# EAGLE schematic 000018 PGKB Rev 1.00 (EAGLE 9.3.0)
DATE: 11.02.2019; OWNER: Kallio Designs; PRODUCT_NUMBER: 000017; REVISION: 1.00; TITLE: PGKB
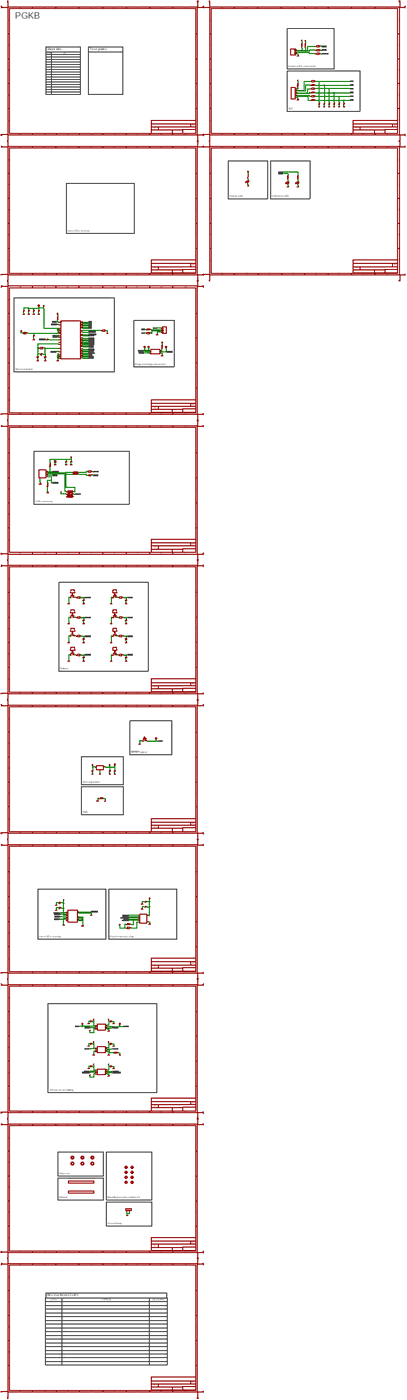
[diagram p0: schematic, sheet 1, overview]
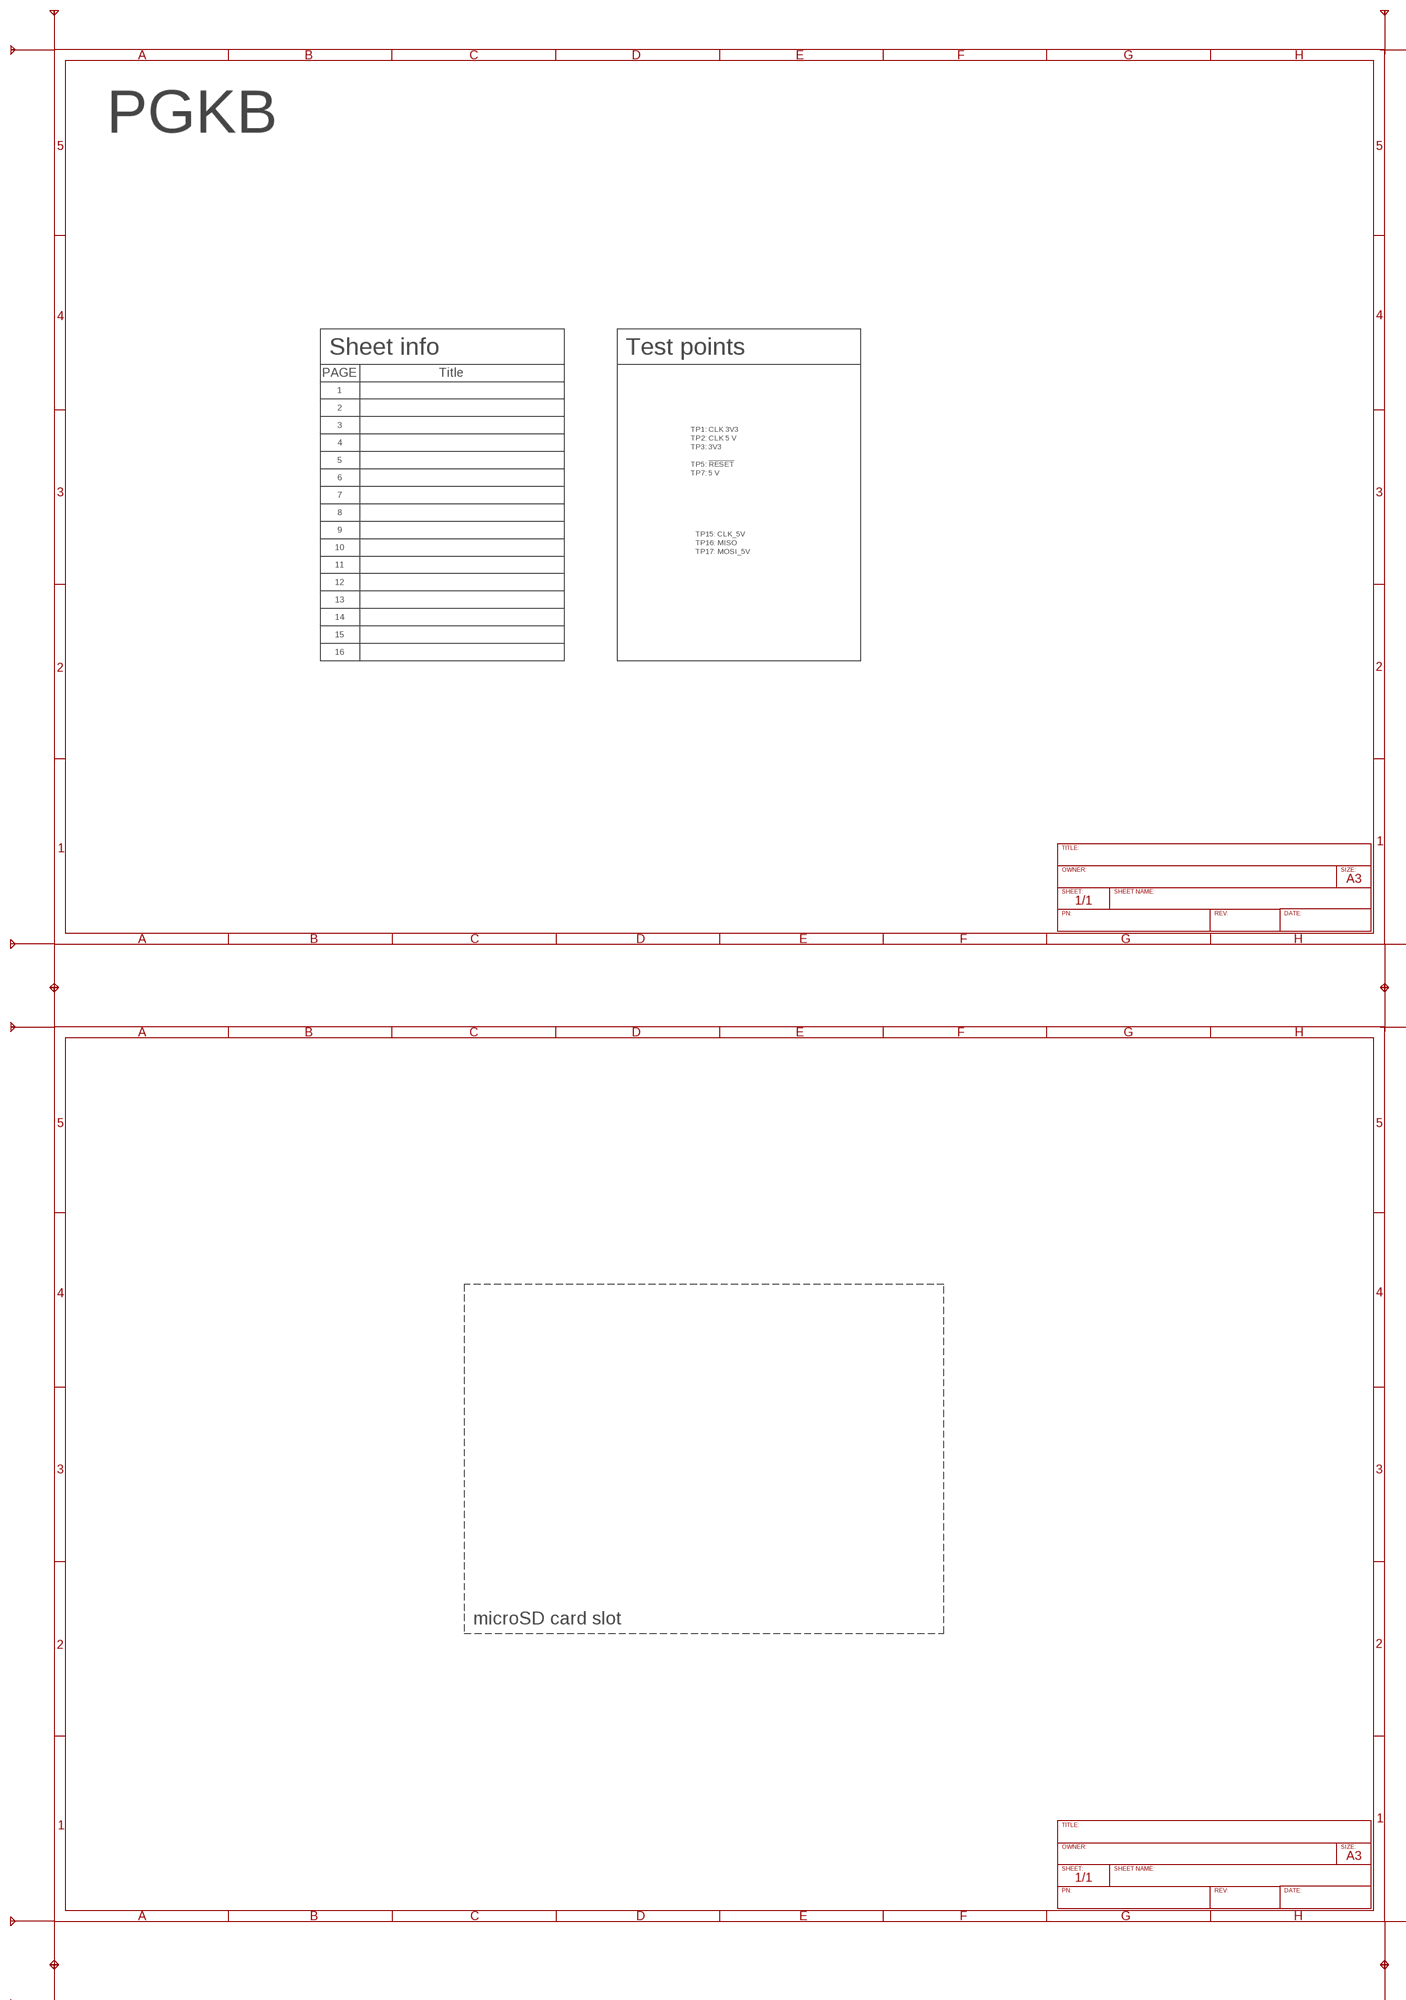
[diagram p1: schematic, sheet 1, part 1 of 7]
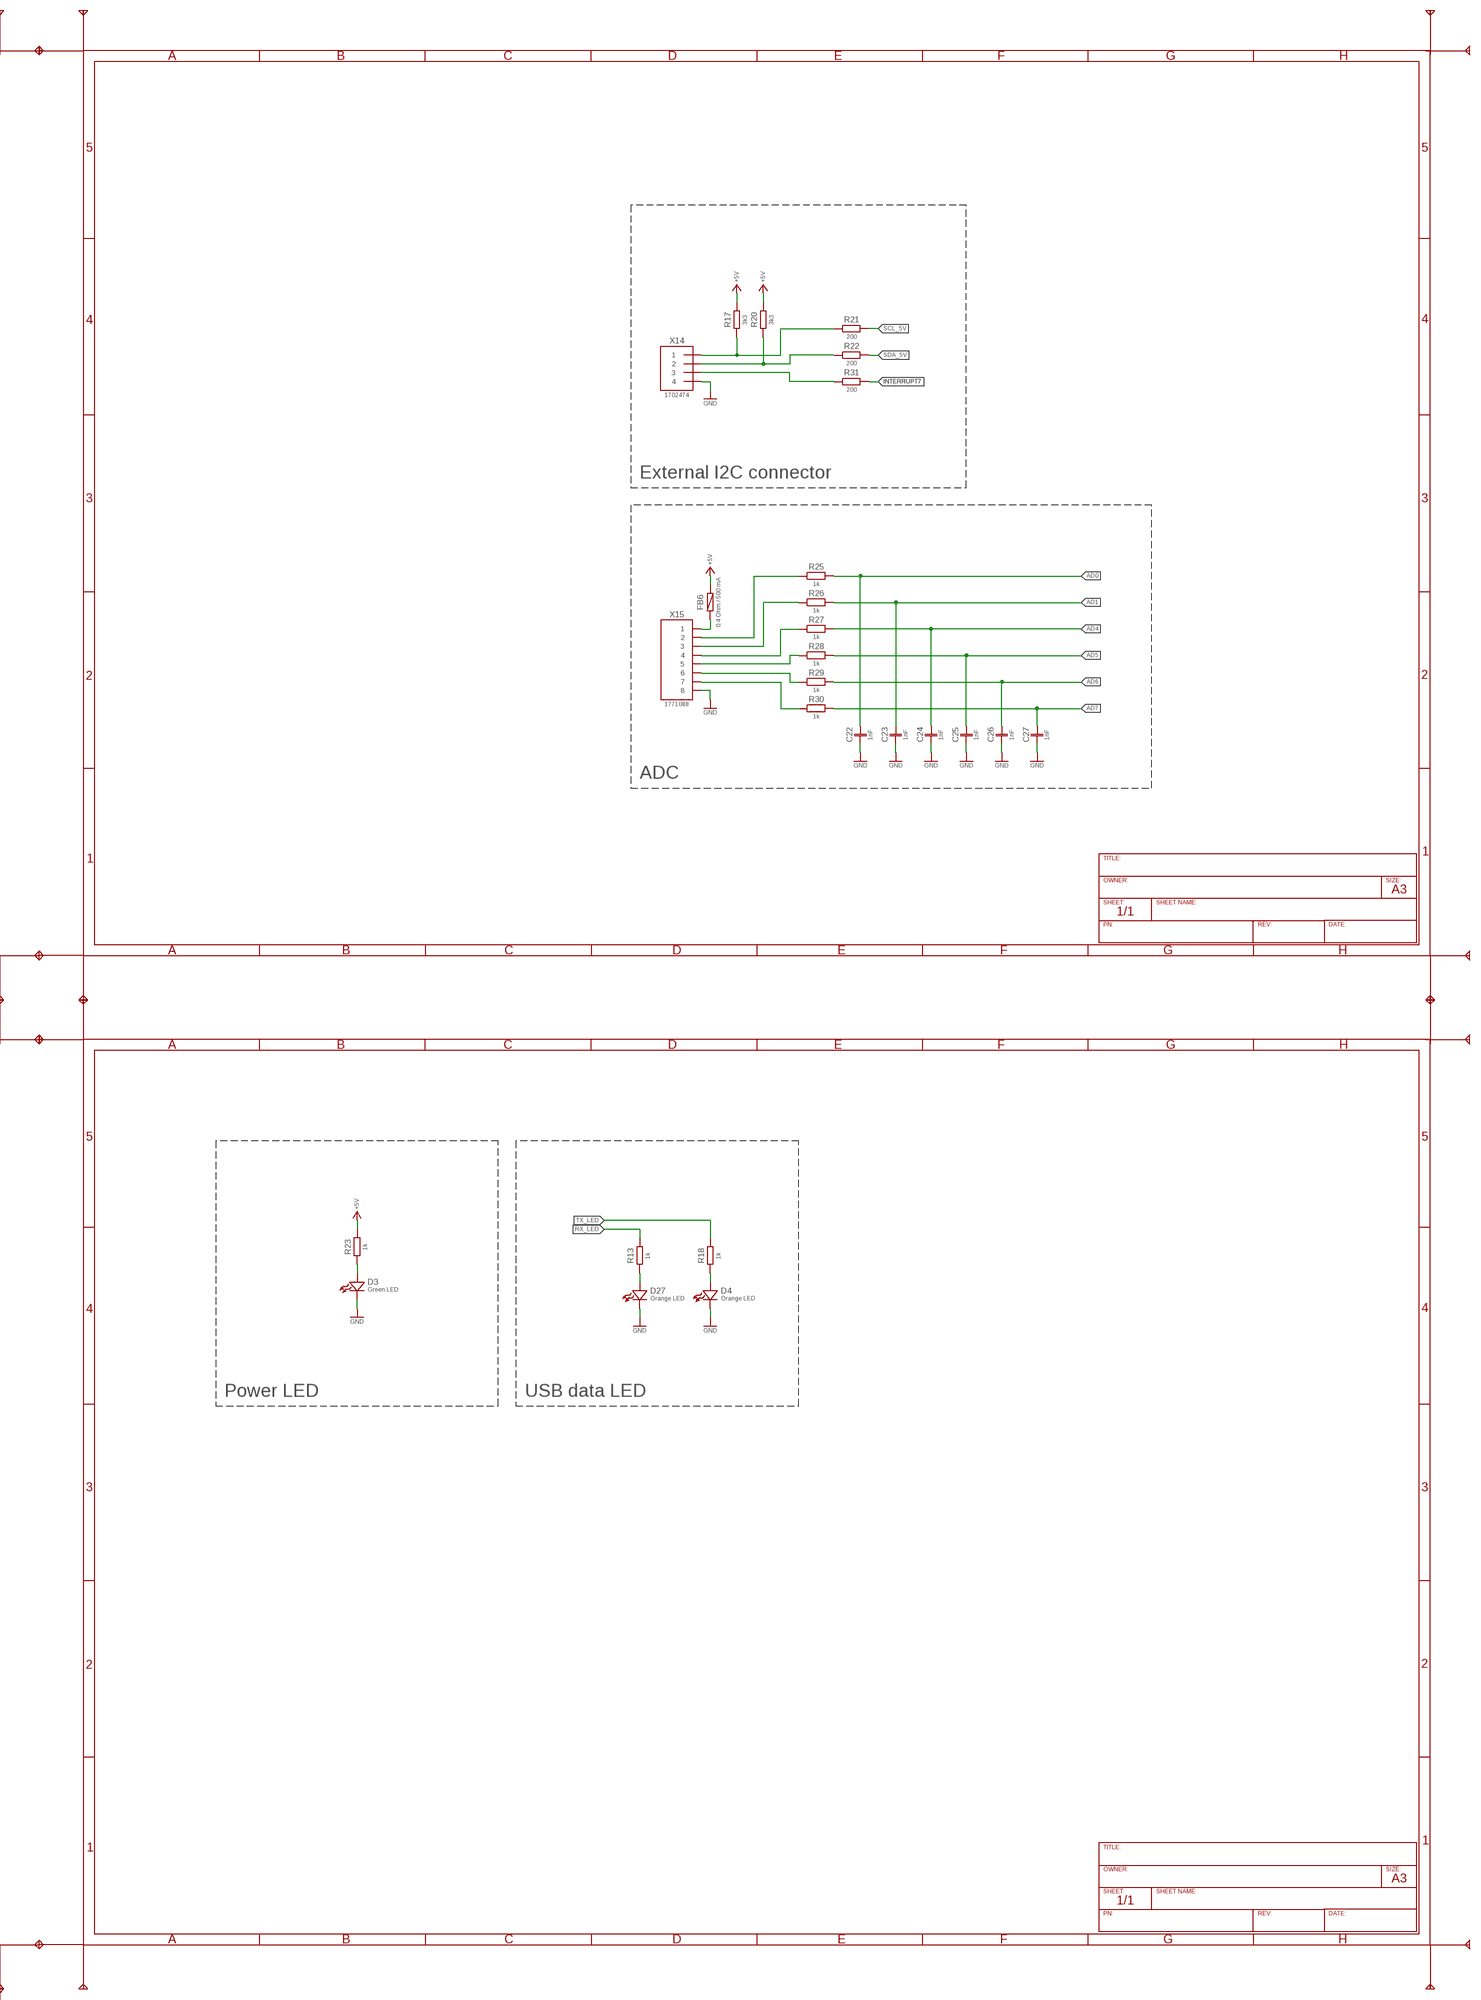
[diagram p2: schematic, sheet 1, part 2 of 7]
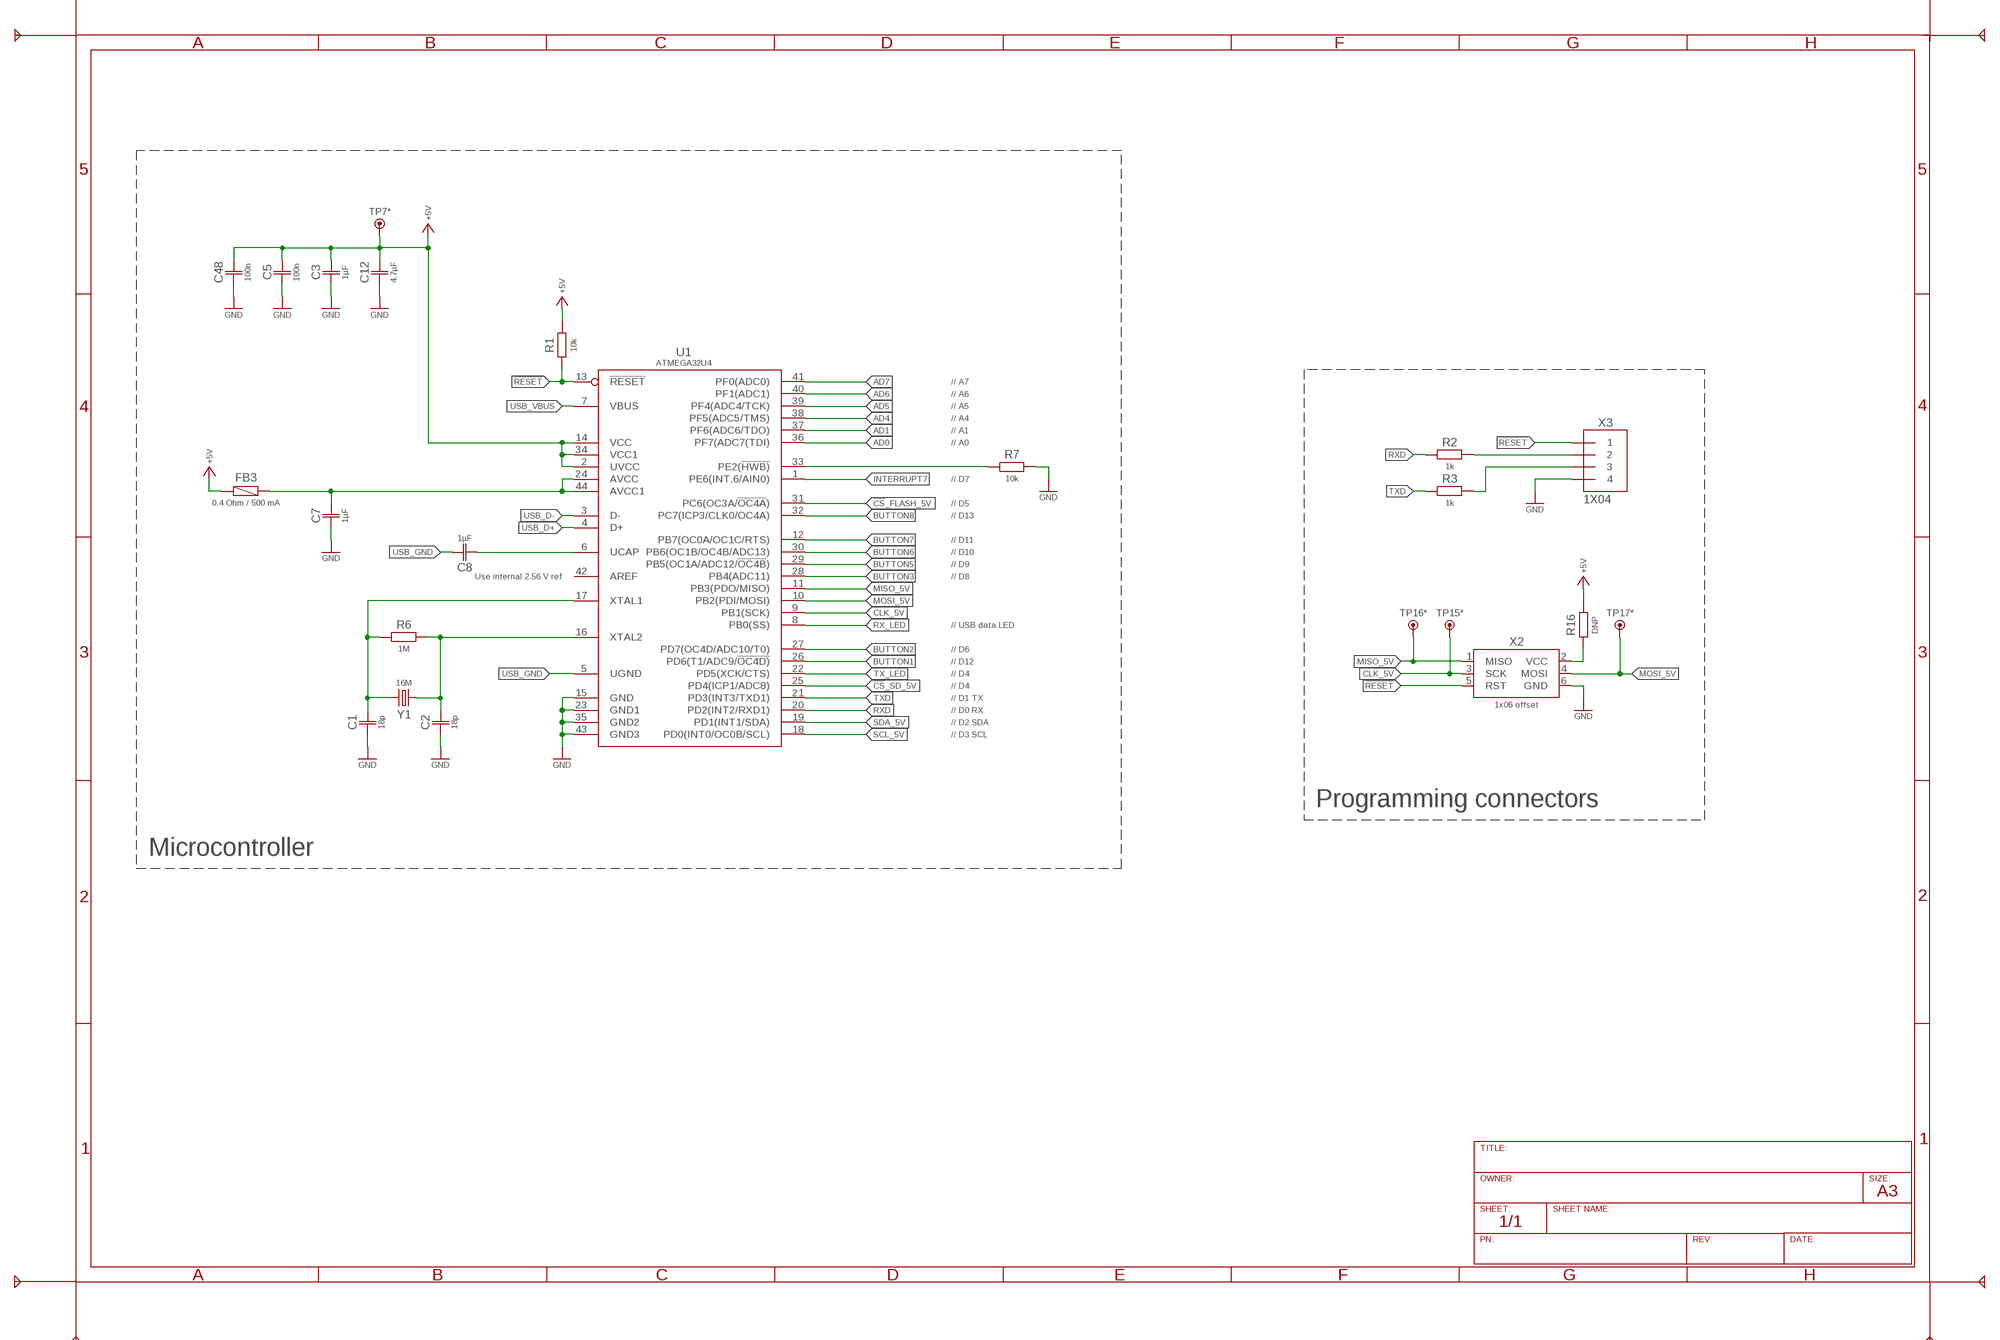
[diagram p3: schematic, sheet 1, part 3 of 7]
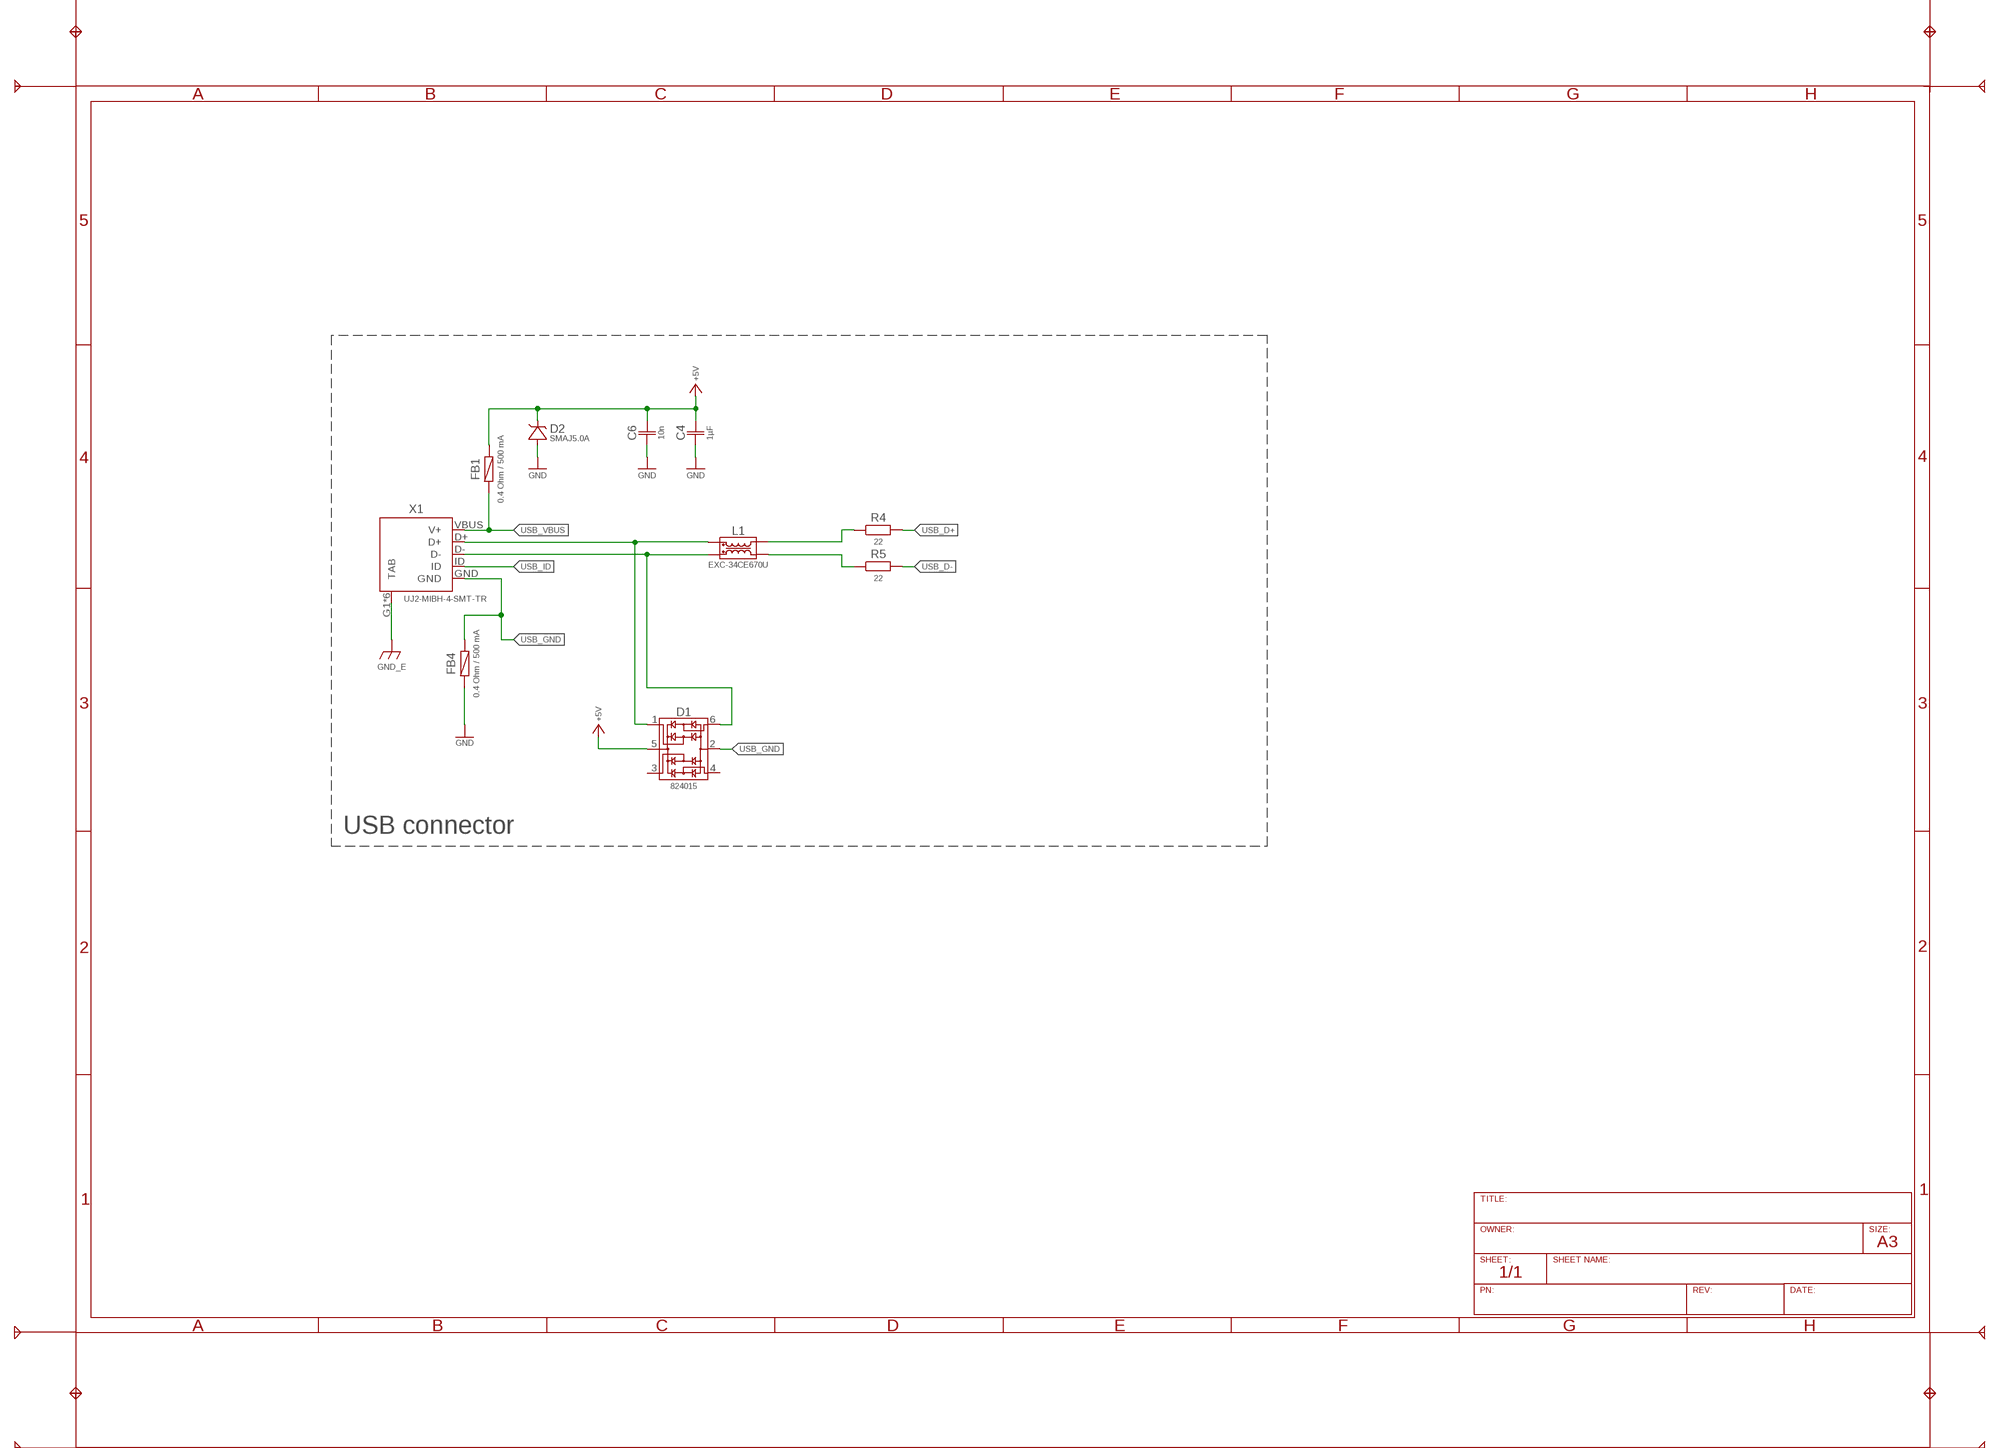
[diagram p4: schematic, sheet 1, part 4 of 7]
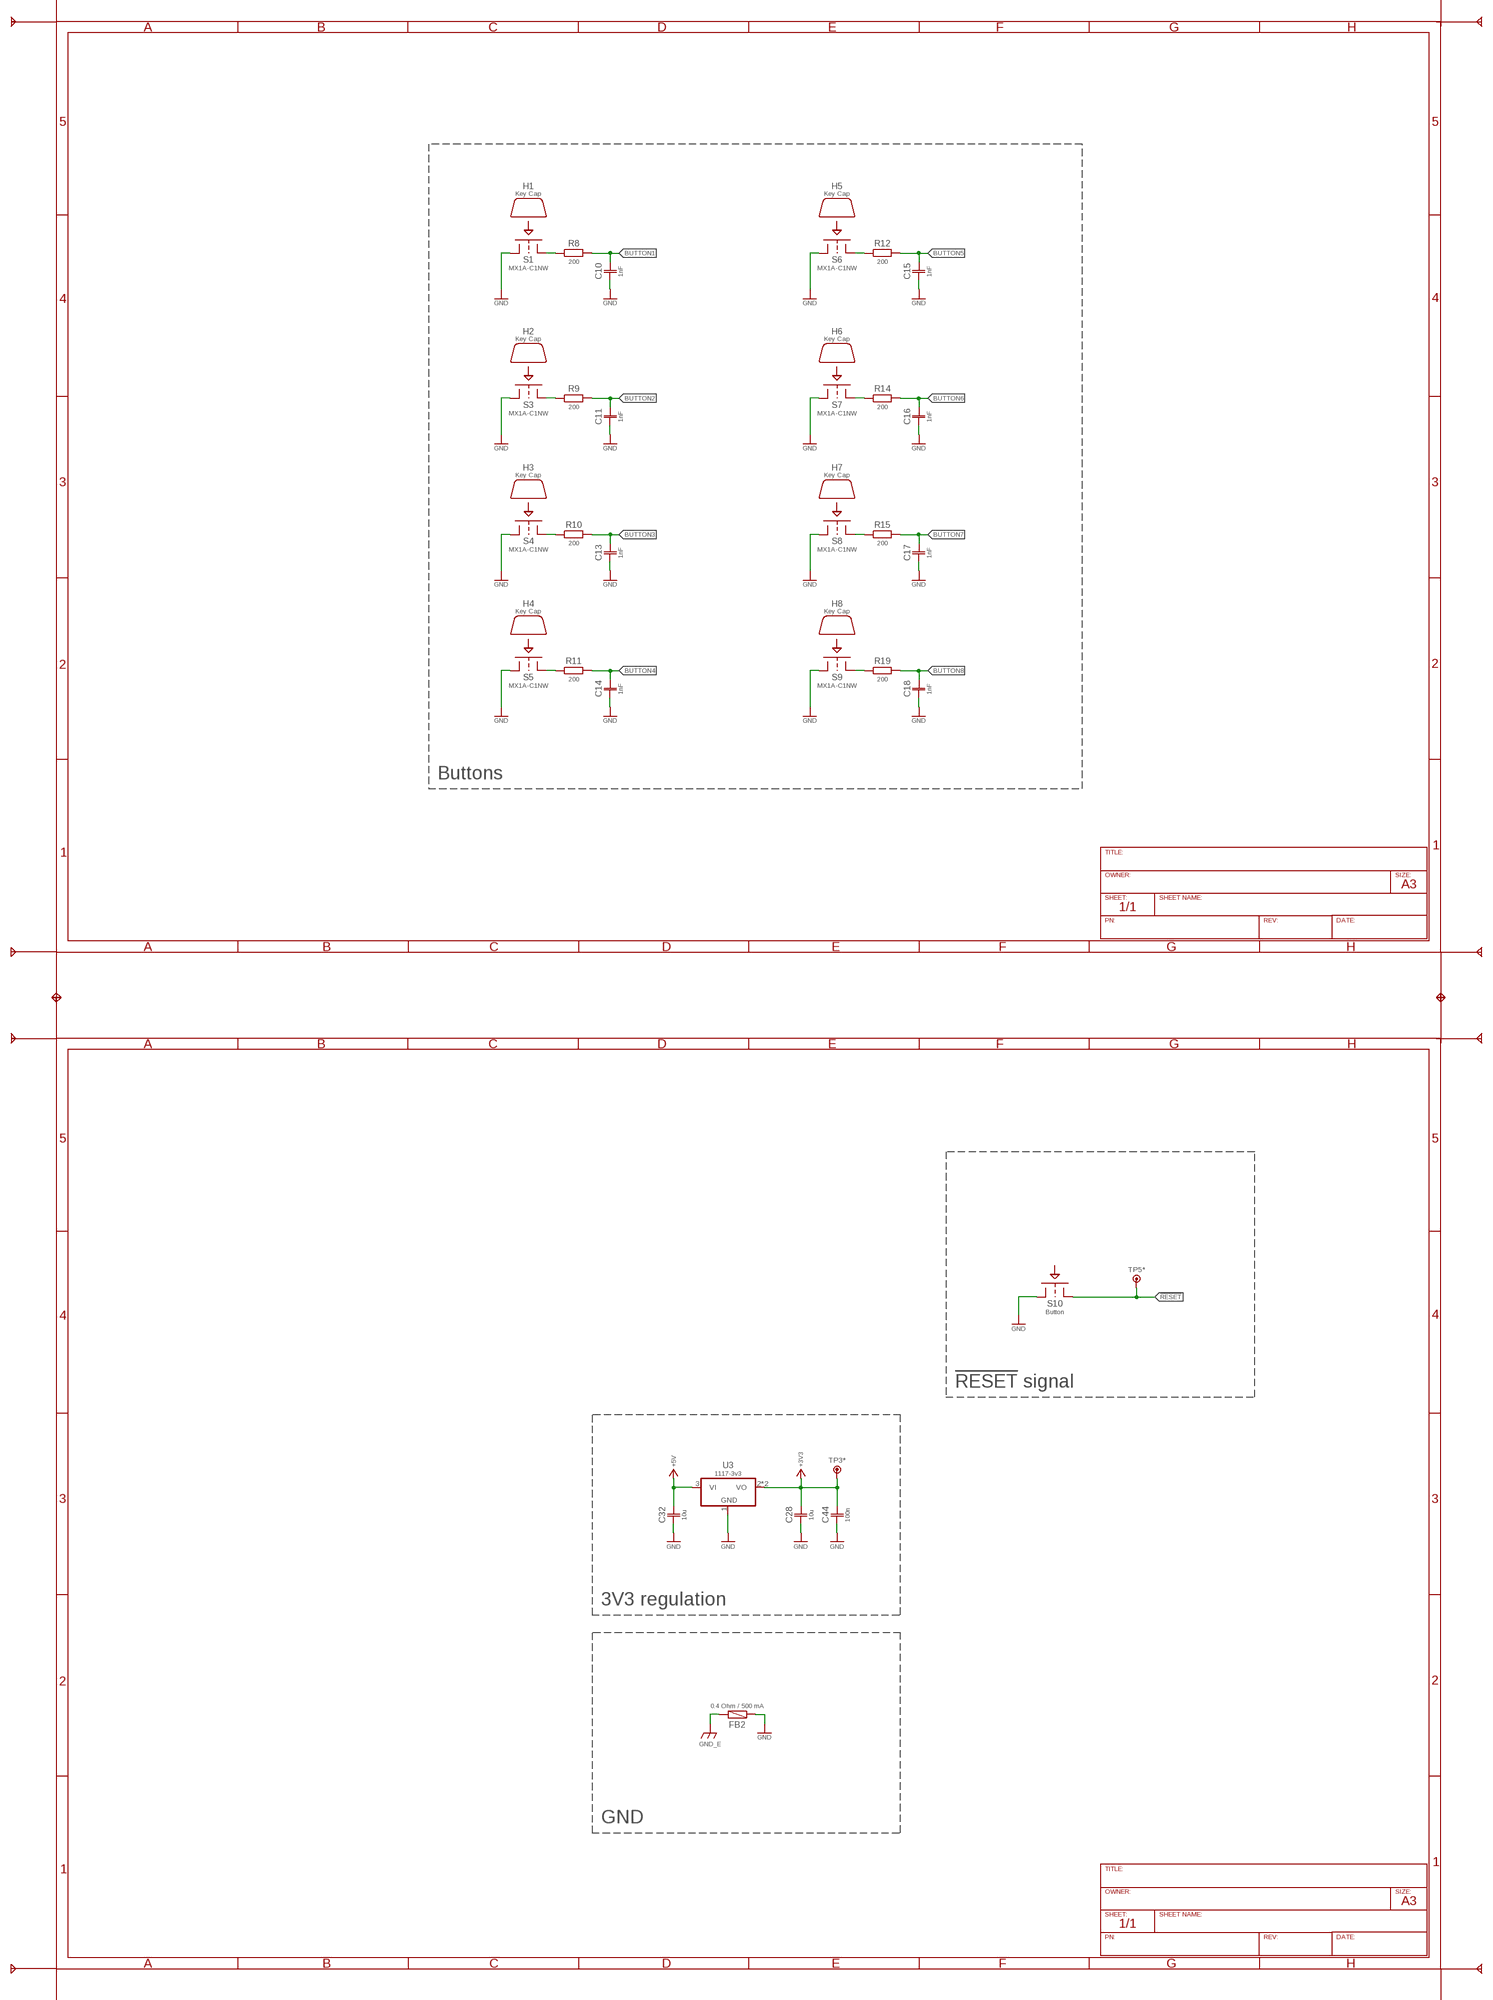
[diagram p5: schematic, sheet 1, part 5 of 7]
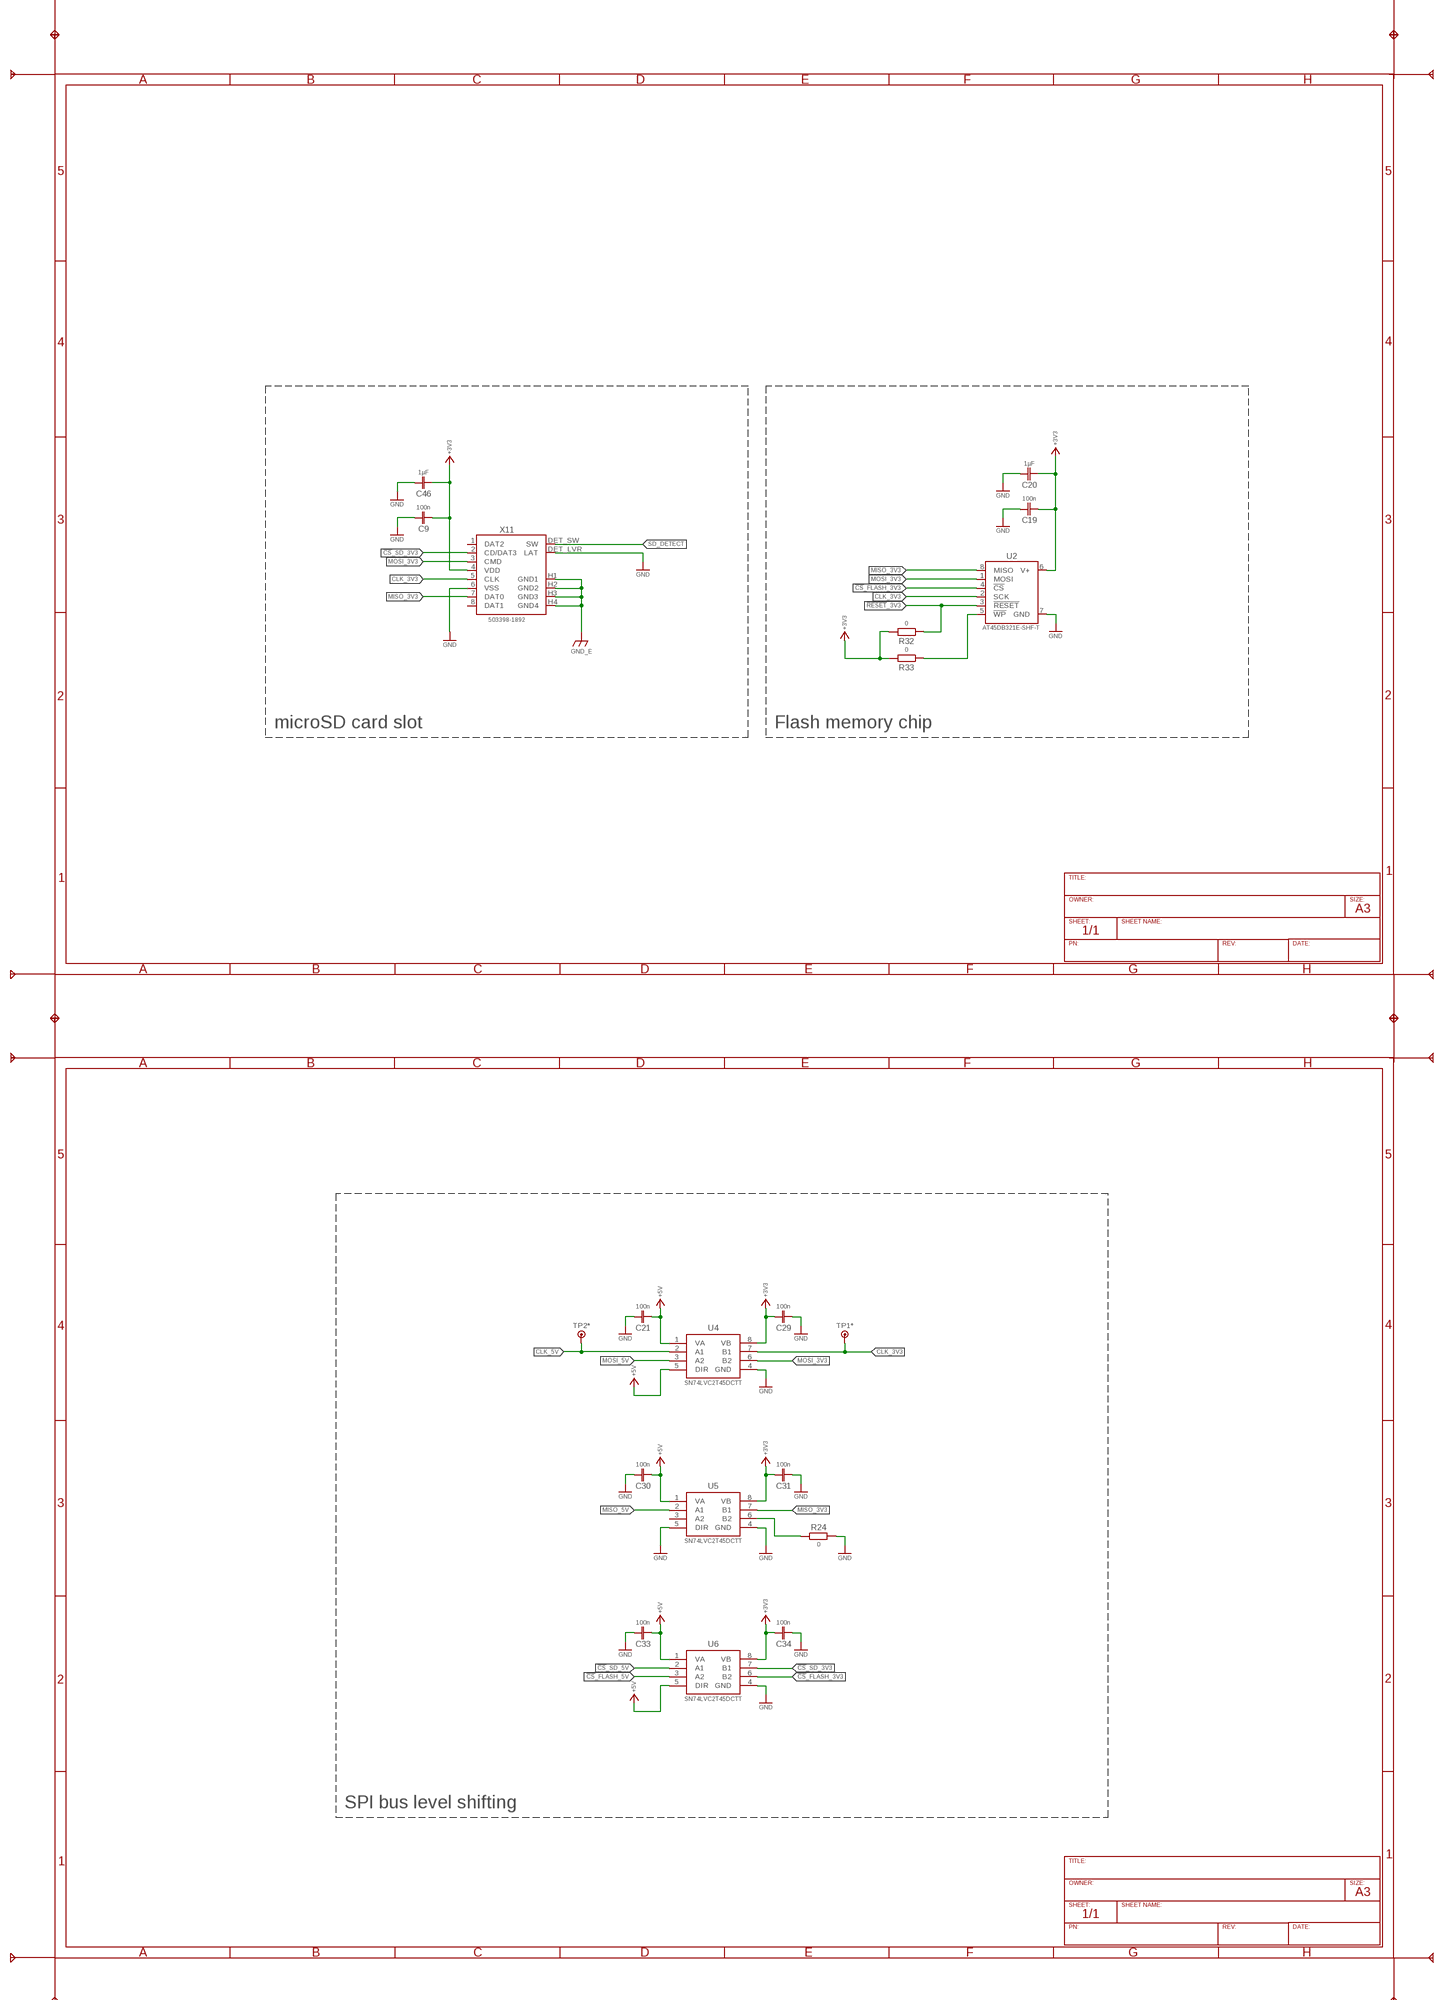
[diagram p6: schematic, sheet 1, part 6 of 7]
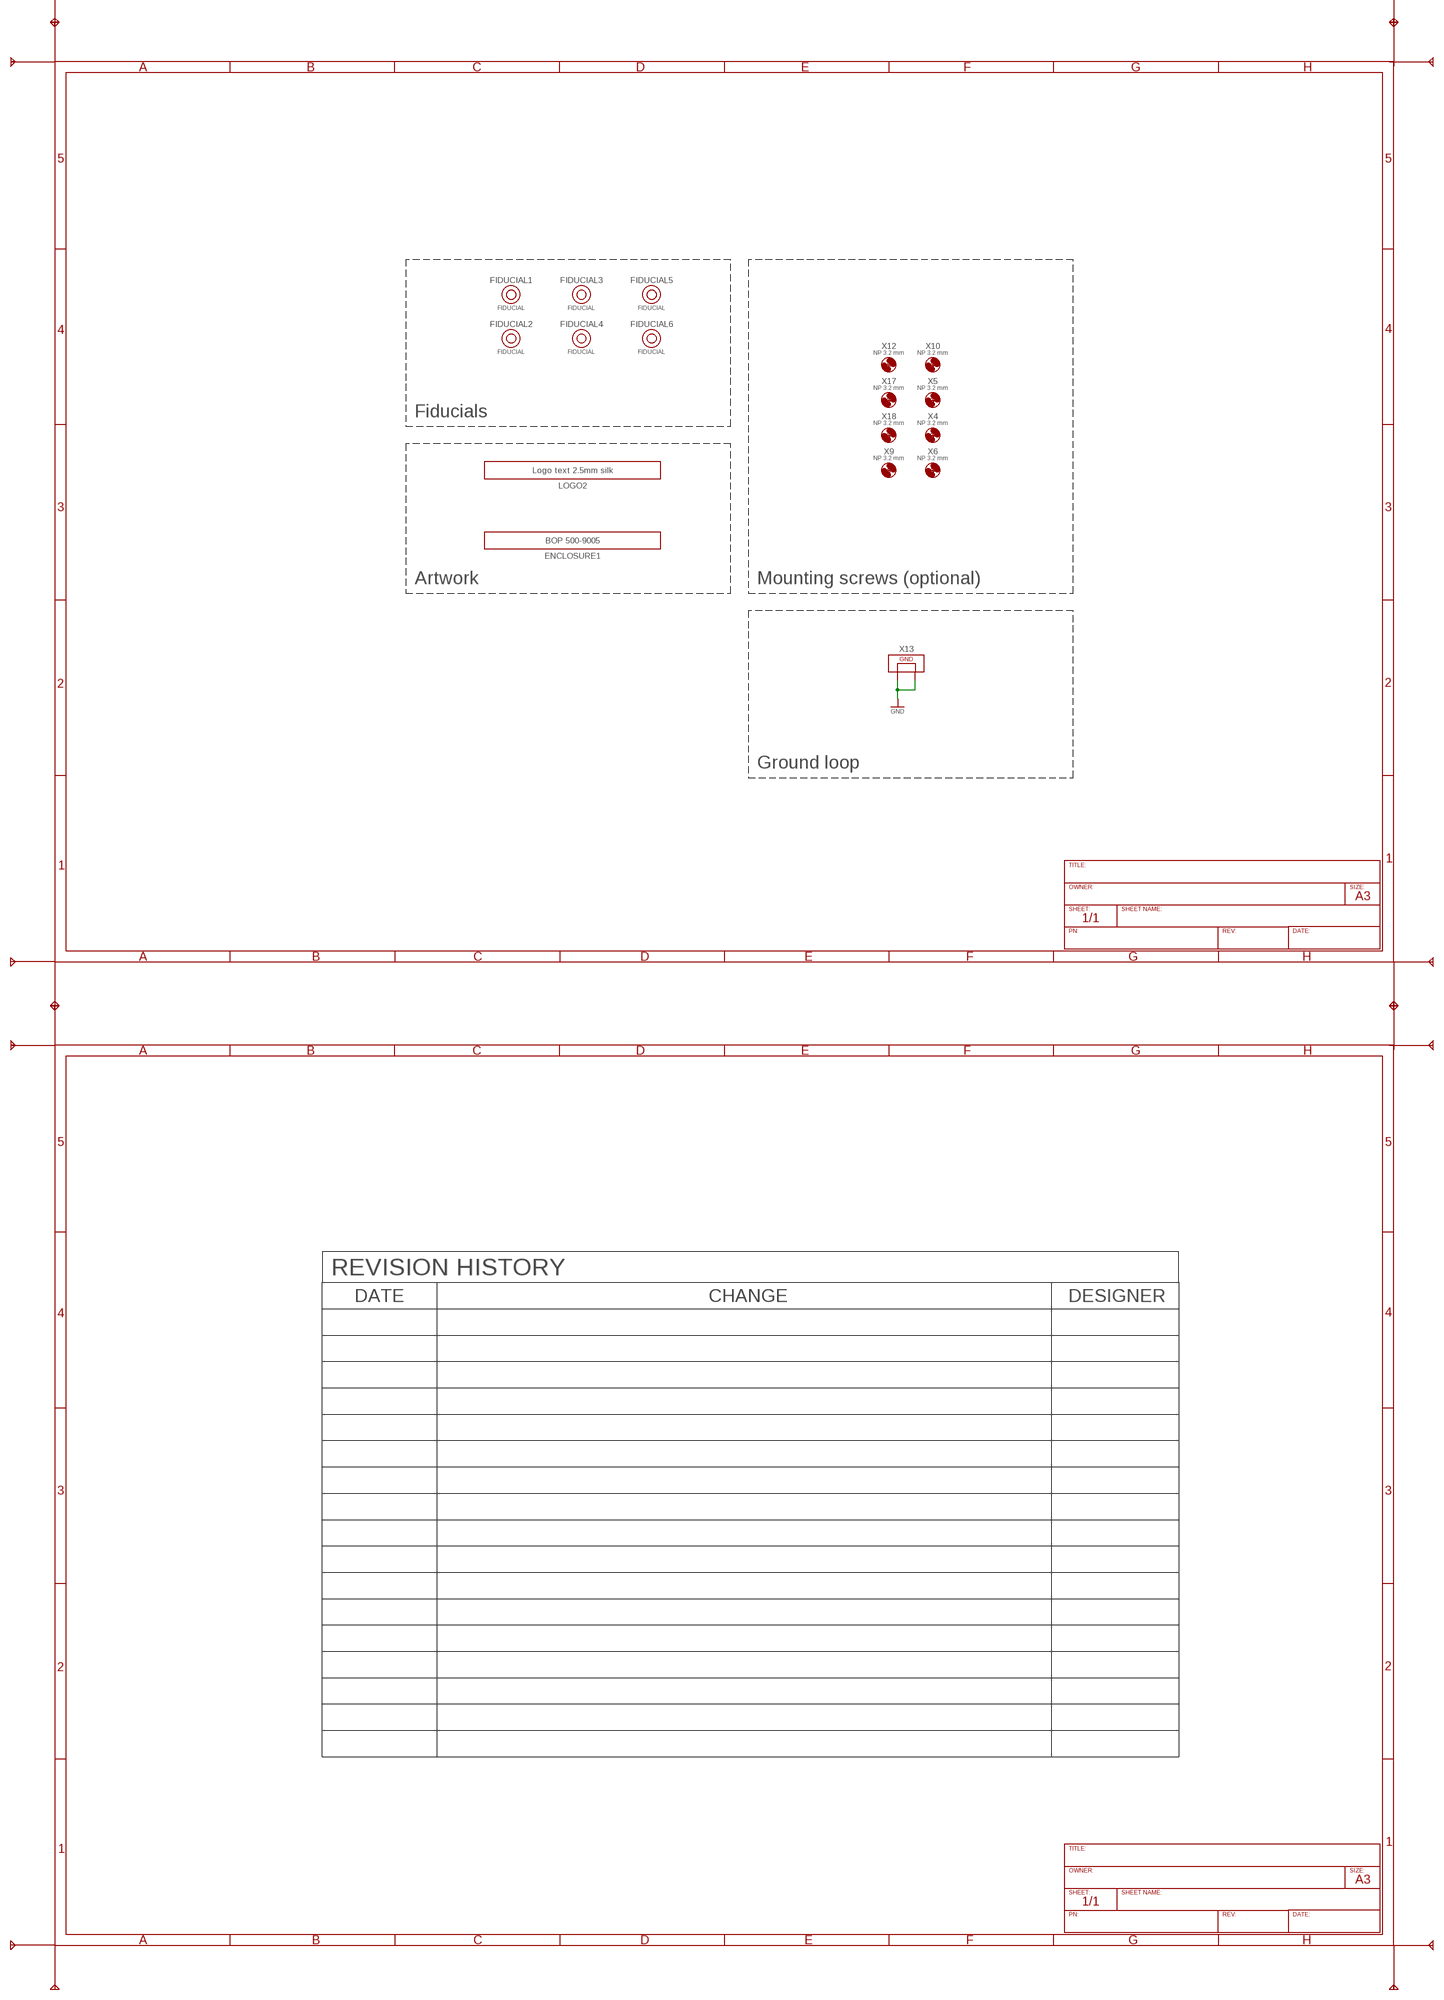
[diagram p7: schematic, sheet 1, part 7 of 7]
REVINFO1 (ART_REVISION_HISTORY): CODE: DNP; DNP: T; MANUFACTURER: DNP; MFG_PARTNO: DNP; PRICE: 0; SUPPLIER: DNP; SUPPLIER_PARTNO: DNP
SHEETINFO1 (ART_SHEET_INFO_1-16): CODE: DNP; DNP: T; MANUFACTURER: DNP; MFG_PARTNO: DNP; PRICE: 0; SUPPLIER: DNP; SUPPLIER_PARTNO: DNP
TEST_POINTS1 (ART_TEST_POINTS): CODE: DNP; DNP: T; MANUFACTURER: DNP; MFG_PARTNO: DNP; PRICE: 0; SUPPLIER: DNP; SUPPLIER_PARTNO: DNP

## Parts
C1  C0805_18PF_50V_NP0  [CAPC2012X160]
C2  C0805_18PF_50V_NP0  [CAPC2012X160]
C3  C0805_1UF_50V_X5R  [CAPC2012X160]
C4  C0805_1UF_50V_X5R  [CAPC2012X160]
C5  C0603_100NF_50V_X7R  [CAPC1608X90]
C6  C0805_10NF_50V_X7R  [CAPC2012X160]
C7  C0805_1UF_50V_X5R  [CAPC2012X160]
C8  C0805_1UF_50V_X5R  [CAPC2012X160]
C9  C0603_100NF_50V_X7R  [CAPC1608X90]
C10  C0805_1NF_50V_X7R  [CAPC2012X160]
C11  C0805_1NF_50V_X7R  [CAPC2012X160]
C12  C0805_4.7UF_25V_X5R  [CAPC2012X160]
C13  C0805_1NF_50V_X7R  [CAPC2012X160]
C14  C0805_1NF_50V_X7R  [CAPC2012X160]
C15  C0805_1NF_50V_X7R  [CAPC2012X160]
C16  C0805_1NF_50V_X7R  [CAPC2012X160]
C17  C0805_1NF_50V_X7R  [CAPC2012X160]
C18  C0805_1NF_50V_X7R  [CAPC2012X160]
C19  C0603_100NF_50V_X7R  [CAPC1608X90]
C20  C0805_1UF_50V_X5R  [CAPC2012X160]
C21  C0603_100NF_50V_X7R  [CAPC1608X90]
C22  C0805_1NF_50V_X7R  [CAPC2012X160]
C23  C0805_1NF_50V_X7R  [CAPC2012X160]
C24  C0805_1NF_50V_X7R  [CAPC2012X160]
C25  C0805_1NF_50V_X7R  [CAPC2012X160]
C26  C0805_1NF_50V_X7R  [CAPC2012X160]
C27  C0805_1NF_50V_X7R  [CAPC2012X160]
C28  C1206_10UF_16V_Y5V  [CAPC3216X200]
C29  C0603_100NF_50V_X7R  [CAPC1608X90]
C30  C0603_100NF_50V_X7R  [CAPC1608X90]
C31  C0603_100NF_50V_X7R  [CAPC1608X90]
C32  C1206_10UF_16V_Y5V  [CAPC3216X200]
C33  C0603_100NF_50V_X7R  [CAPC1608X90]
C34  C0603_100NF_50V_X7R  [CAPC1608X90]
C44  C0603_100NF_50V_X7R  [CAPC1608X90]
C46  C0805_1UF_50V_X5R  [CAPC2012X160]
C48  C0603_100NF_50V_X7R  [CAPC1608X90]
D1  DIODE_TVS_5V_BI_824015  [SOP95P280X120-6N]
D2  DIODE_TVS_5V_SMAJ5.0A  [DIOC530X280X230_SMA_A]
D3  LED_0603_GREEN_CLEAR_APTD1608CGCK  [LEDM1608X80N_DOME]
D4  LED_0603_AMBER_DIFF_LOQ976-PS-25  [LEDM1608X80N]
D27  LED_0603_AMBER_DIFF_LOQ976-PS-25  [LEDM1608X80N]
ENCLOSURE1  ENCLOSURE_BOPLA_BOP-500-9005-TOP  [ENCLOSURE_BOPLA_BOP-500-9005]
FB1  FERRITE_0805_0A5  [RESC2012X50]
FB2  FERRITE_0805_0A5  [RESC2012X50]
FB3  FERRITE_0805_0A5  [RESC2012X50]
FB4  FERRITE_0805_0A5  [RESC2012X50]
FB6  FERRITE_0805_0A5  [RESC2012X50]
FIDUCIAL1  FIDUCIAL  [FIDUCIAL]
FIDUCIAL2  FIDUCIAL  [FIDUCIAL]
FIDUCIAL3  FIDUCIAL  [FIDUCIAL]
FIDUCIAL4  FIDUCIAL  [FIDUCIAL]
FIDUCIAL5  FIDUCIAL  [FIDUCIAL]
FIDUCIAL6  FIDUCIAL  [FIDUCIAL]
H1  SWITCH_CAP_DSA_RELEG  [SWITCH_CAP_DSA_RELEG]
H2  SWITCH_CAP_DSA_RELEG  [SWITCH_CAP_DSA_RELEG]
H3  SWITCH_CAP_DSA_RELEG  [SWITCH_CAP_DSA_RELEG]
H4  SWITCH_CAP_DSA_RELEG  [SWITCH_CAP_DSA_RELEG]
H5  SWITCH_CAP_DSA_RELEG  [SWITCH_CAP_DSA_RELEG]
H6  SWITCH_CAP_DSA_RELEG  [SWITCH_CAP_DSA_RELEG]
H7  SWITCH_CAP_DSA_RELEG  [SWITCH_CAP_DSA_RELEG]
H8  SWITCH_CAP_DSA_RELEG  [SWITCH_CAP_DSA_RELEG]
L1  L_CHOKE_EXC-34CE670U  [IND_CHOKE_EXC-34]
LOGO2  ART_LOGO_TEXT_2.5MM-SILK  [ART_LOGO_TEXT_2.5MM_SILK]
R1  R0805_10K_5%  [RESC2012X50]
R2  R0805_1K_1%  [RESC2012X50]
R3  R0805_1K_1%  [RESC2012X50]
R4  R0603_22  [RESC1608X45N]
R5  R0603_22  [RESC1608X45N]
R6  R0805_1M_5%  [RESC2012X50]
R7  R0805_10K_5%  [RESC2012X50]
R8  R0805_200_1%  [RESC2012X50]
R9  R0805_200_1%  [RESC2012X50]
R10  R0805_200_1%  [RESC2012X50]
R11  R0805_200_1%  [RESC2012X50]
R12  R0805_200_1%  [RESC2012X50]
R13  R0805_1K_1%  [RESC2012X50]
R14  R0805_200_1%  [RESC2012X50]
R15  R0805_200_1%  [RESC2012X50]
R16  R0402_DNP  [RESC1005X35N]
R17  R0805_3K3_1%  [RESC2012X50]
R18  R0805_1K_1%  [RESC2012X50]
R19  R0805_200_1%  [RESC2012X50]
R20  R0805_3K3_1%  [RESC2012X50]
R21  R0805_200_1%  [RESC2012X50]
R22  R0805_200_1%  [RESC2012X50]
R23  R0805_1K_1%  [RESC2012X50]
R24  R0603_0  [RESC1608X45N]
R25  R0805_1K_1%  [RESC2012X50]
R26  R0805_1K_1%  [RESC2012X50]
R27  R0805_1K_1%  [RESC2012X50]
R28  R0805_1K_1%  [RESC2012X50]
R29  R0805_1K_1%  [RESC2012X50]
R30  R0805_1K_1%  [RESC2012X50]
R31  R0805_200_1%  [RESC2012X50]
R32  R0603_0  [RESC1608X45N]
R33  R0603_0  [RESC1608X45N]
S1  SWITCH_BUTTON_MX1A-C1NW  [SWITCH_BUTTON_CHERRY_MX]
S3  SWITCH_BUTTON_MX1A-C1NW  [SWITCH_BUTTON_CHERRY_MX]
S4  SWITCH_BUTTON_MX1A-C1NW  [SWITCH_BUTTON_CHERRY_MX]
S5  SWITCH_BUTTON_MX1A-C1NW  [SWITCH_BUTTON_CHERRY_MX]
S6  SWITCH_BUTTON_MX1A-C1NW  [SWITCH_BUTTON_CHERRY_MX]
S7  SWITCH_BUTTON_MX1A-C1NW  [SWITCH_BUTTON_CHERRY_MX]
S8  SWITCH_BUTTON_MX1A-C1NW  [SWITCH_BUTTON_CHERRY_MX]
S9  SWITCH_BUTTON_MX1A-C1NW  [SWITCH_BUTTON_CHERRY_MX]
S10  SWITCH_MOM_SPST_FSM4JSMA  [SWITCH_BUTTON_TE_FSM4JSMA]
TP1  PAD_TEST_POINT-2.5/0.7_A  [TEST_POINT_2.5MM_0.7HOLE_1SIDE]
TP2  PAD_TEST_POINT-2.5/0.7_A  [TEST_POINT_2.5MM_0.7HOLE_1SIDE]
TP3  PAD_TEST_POINT-2.5/0.7_A  [TEST_POINT_2.5MM_0.7HOLE_1SIDE]
TP5  PAD_TEST_POINT-2.5/0.7_A  [TEST_POINT_2.5MM_0.7HOLE_1SIDE]
TP7  PAD_TEST_POINT-2.5/0.7_A  [TEST_POINT_2.5MM_0.7HOLE_1SIDE]
TP15  PAD_TEST_POINT-2.5/0.7_A  [TEST_POINT_2.5MM_0.7HOLE_1SIDE]
TP16  PAD_TEST_POINT-2.5/0.7_A  [TEST_POINT_2.5MM_0.7HOLE_1SIDE]
TP17  PAD_TEST_POINT-2.5/0.7_A  [TEST_POINT_2.5MM_0.7HOLE_1SIDE]
U1  IC_MCU_ATMEGA32U4-AU  [QFP80P1000X1000X120-44R_N]
U2  IC_MEM_FLASH_AT45DB321E  [SOP127P800X175-8]
U3  IC_REG_3V3_1A_NCP1117LPST33T3G  [SOT223]
U4  IC_LEVEL_SHIFTER_SN74LVC2T45  [SOP65P400X130-8]
U5  IC_LEVEL_SHIFTER_SN74LVC2T45  [SOP65P400X130-8]
U6  IC_LEVEL_SHIFTER_SN74LVC2T45  [SOP65P400X130-8]
X1  CON_USB_MICROB_UJ2-MIBH-4-SMT-TR-MAN  [CON_USB_MICROB_UJ2-MIBH-4-SMT-TR_MAN]
X2  CON_PROG_AVR_ISP-OFFSET_1X06  [CON_PINHD_1X06_TH_OFFSET]
X3  CON_1X04_TH_OFFSET_PADS-SILK  [1X04_TH_OFFSET]
X4  HOL_3.2/6.0_NP  [MTG_NP_M3_320X600]
X5  HOL_3.2/6.0_NP  [MTG_NP_M3_320X600]
X6  HOL_3.2/6.0_NP  [MTG_NP_M3_320X600]
X9  HOL_3.2/6.0_NP  [MTG_NP_M3_320X600]
X10  HOL_3.2/6.0_NP  [MTG_NP_M3_320X600]
X11  CON_MICROSD_MOLEX_5033981892-M  [CON_MICROSD_MOLEX_5033981892_M]
X12  HOL_3.2/6.0_NP  [MTG_NP_M3_320X600]
X13  PAD_TEST_GROUND_HOOK  [PAD_GND_HOOK_M]
X14  CON_CLAMP_PTSM_1X04_H_SMD  [CON_PHOENIX_CONTACT_1702474]
X15  CON_CLAMP_PTSM_1X08_H_SMD  [CON_PHOENIX_CONTACT_1771088]
X17  HOL_3.2/6.0_NP  [MTG_NP_M3_320X600]
X18  HOL_3.2/6.0_NP  [MTG_NP_M3_320X600]
Y1  OSC_CRYSTAL_16M_ABLS-16.000MHZ-B4-T-HC49  [OSC_CRYSTAL_HC49/US]

## Nets
!CS!_FLASH_3V3: U2.4(!CS!) U6.6(B2)
!CS!_FLASH_5V: U1.31(PC6(OC3A/!OC4A!)) U6.3(A2)
!CS!_SD_3V3: U6.7(B1) X11.2(CD/DAT3)
!CS!_SD_5V: U1.25(PD4(ICP1/ADC8)) U6.2(A1)
!RESET: R1.P$1 S10.1 TP5.P$1 U1.13(!RESET) X2.5(RST) X3.1
!RESET!_3V3: R32.P$1 U2.3(!RESET!)
+3V3 [+3v3]: C9.P$2 C19.P$2 C20.P$2 C28.P$1 C29.P$1 C31.P$1 C34.P$1 C44.P$1 C46.P$2 R32.P$2 R33.P$2 TP3.P$1 U2.6(V+) U3.2(VO) U3.4(VO) U4.8(VB) U5.8(VB) U6.8(VB) X11.4(VDD)
+5V [+5V]: C3.P$1 C4.P$1 C5.P$1 C6.P$1 C12.P$1 C21.P$2 C30.P$2 C32.P$1 C33.P$2 C48.P$1 D1.5(V+) D2.C(K) FB1.P$2 FB3.P$1 FB6.P$2 R1.P$2 R16.P$2 R17.P$2 R20.P$2 R23.P$2 TP7.P$1 U1.2(UVCC) U1.14(VCC) U1.34(VCC1) U3.3(VI) U4.1(VA) U4.5(DIR) U5.1(VA) U6.1(VA) U6.5(DIR)
AD0: C22.P$1 R25.P$2 U1.36(PF7(ADC7(TDI))
AD1: C23.P$1 R26.P$2 U1.37(PF6(ADC6/TDO))
AD4: C24.P$1 R27.P$2 U1.38(PF5(ADC5/TMS))
AD5: C25.P$1 R28.P$2 U1.39(PF4(ADC4/TCK))
AD6: C26.P$1 R29.P$2 U1.40(PF1(ADC1))
AD7: C27.P$1 R30.P$2 U1.41(PF0(ADC0))
BUTTON1: C10.P$1 R8.P$2 U1.26(PD6(T1/ADC9/!OC4D))
BUTTON2: C11.P$1 R9.P$2 U1.27(PD7(OC4D/ADC10/T0))
BUTTON3: C13.P$1 R10.P$2 U1.28(PB4(ADC11))
BUTTON4: C14.P$1 R11.P$2
BUTTON5: C15.P$1 R12.P$2 U1.29(PB5(OC1A/ADC12/!OC4B!))
BUTTON6: C16.P$1 R14.P$2 U1.30(PB6(OC1B/OC4B/ADC13))
BUTTON7: C17.P$1 R15.P$2 U1.12(PB7(OC0A/OC1C/RTS))
BUTTON8: C18.P$1 R19.P$2 U1.32(PC7(ICP3/CLK0/OC4A))
CLK_3V3 [Serial]: TP1.P$1 U2.2(SCK) U4.7(B1) X11.5(CLK)
CLK_5V [Serial]: TP2.P$1 TP15.P$1 U1.9(PB1(SCK)) U4.2(A1) X2.3(SCK)
GND [PWR]: C1.P$2 C2.P$2 C3.P$2 C4.P$2 C5.P$2 C6.P$2 C7.P$2 C9.P$1 C10.P$2 C11.P$2 C12.P$2 C13.P$2 C14.P$2 C15.P$2 C16.P$2 C17.P$2 C18.P$2 C19.P$1 C20.P$1 C21.P$1 C22.P$2 C23.P$2 C24.P$2 C25.P$2 C26.P$2 C27.P$2 C28.P$2 C29.P$2 C30.P$1 C31.P$2 C32.P$2 C33.P$1 C34.P$2 C44.P$2 C46.P$1 C48.P$2 D2.A D3.C(CATHODE) D4.C(CATHODE) D27.C(CATHODE) FB2.P$1 FB4.P$1 R7.P$2 R24.P$2 S1.1 S3.1 S4.1 S5.1 S6.1 S7.1 S8.1 S9.1 S10.3 U1.15(GND) U1.23(GND1) U1.35(GND2) U1.43(GND3) U2.7(GND) U3.1(GND) U4.4(GND) U5.4(GND) U5.5(DIR) U6.4(GND) X2.6(GND) X3.4 X11.6(VSS) X11.DET_LVR(LAT) X13.P$1 X13.P$2 X14.4 X15.8
GND_E [PWR]: FB2.P$2 X1.G1(TAB) X1.G2(TAB) X1.H1(TAB) X1.H2(TAB) X1.H3(TAB) X1.H4(TAB) X11.H1(GND1) X11.H2(GND2) X11.H3(GND3) X11.H4(GND4)
INTERRUPT7: R31.P$2 U1.1(PE6(INT.6/AIN0))
MISO_3V3 [Serial]: U2.8(MISO) U5.7(B1) X11.7(DAT0)
MISO_5V [Serial]: TP16.P$1 U1.11(PB3(PDO/MISO)) U5.2(A1) X2.1(MISO)
MOSI_3V3 [Serial]: U2.1(MOSI) U4.6(B2) X11.3(CMD)
MOSI_5V [Serial]: TP17.P$1 U1.10(PB2(PDI/MOSI)) U4.3(A2) X2.4(MOSI)
N$1: D1.1 L1.A2 X1.D+
N$2: D1.6 L1.B2 X1.D-
N$3: C7.P$1 FB3.P$2 U1.24(AVCC) U1.44(AVCC1)
N$4: D4.A(ANODE) R18.P$1
N$5: C1.P$1 R6.P$1 U1.17(XTAL1) Y1.2
N$6: C2.P$1 R6.P$2 U1.16(XTAL2) Y1.1
N$7: C8.P$2 U1.6(UCAP)
N$8: R2.P$2 X3.2
N$9: R3.P$2 X3.3
N$11: R7.P$1 U1.33(PE2(!HWB))
N$12: D27.A(ANODE) R13.P$1
N$13: R8.P$1 S1.2
N$14: R16.P$1 X2.2(VCC)
N$15: R9.P$1 S3.2
N$16: R10.P$1 S4.2
N$17: R11.P$1 S5.2
N$18: R12.P$1 S6.2
N$19: R14.P$1 S7.2
N$20: R15.P$1 S8.2
N$21: R19.P$1 S9.2
N$22: L1.B1 R5.P$1
N$23: L1.A1 R4.P$1
N$24: R33.P$1 U2.5(!WP!)
N$25: R17.P$1 R21.P$1 X14.1
N$26: R20.P$1 R22.P$1 X14.2
N$27: D3.A(ANODE) R23.P$1
N$28 [Serial]: R24.P$1 U5.6(B2)
N$29 [+5V]: FB6.P$1 X15.1
N$30: R27.P$1 X15.4
N$31: R28.P$1 X15.5
N$32: R31.P$1 X14.3
N$36: R25.P$1 X15.2
N$37: R26.P$1 X15.3
N$38: R29.P$1 X15.6
N$39: R30.P$1 X15.7
RX_LED: R13.P$2 U1.8(PB0(SS))
RXD: R2.P$1 U1.20(PD2(INT2/RXD1))
SCL_5V: R21.P$2 U1.18(PD0(INT0/OC0B/SCL))
SD_DETECT: X11.DET_SW(SW)
SDA_5V: R22.P$2 U1.19(PD1(INT1/SDA))
TX_LED: R18.P$2 U1.22(PD5(XCK/CTS))
TXD: R3.P$1 U1.21(PD3(INT3/TXD1))
USB_D+: R4.P$2 U1.4(D+)
USB_D-: R5.P$2 U1.3(D-)
USB_GND: C8.P$1 D1.2(V-) FB4.P$2 U1.5(UGND) X1.GND
USB_ID: X1.ID
USB_VBUS: FB1.P$1 U1.7(VBUS) X1.VBUS(V+)
Unconnected: D1.3 D1.4 U1.42(AREF) U5.3(A2) X11.1(DAT2) X11.8(DAT1)

## Notes on the sheet
- External I2C connector
- ADC
- Power LED | USB data LED
- microSD card slot
- // A7
- // A6
- // A5
- // A4
- // A1
- // A0
- // D7
- // D5
- // D13
- // D11
- // D10
- // D9
- Use internal 2.56 V ref | // D8
- // USB data LED
- // D6
- // D12
- // D4
- // D4
- // D1 TX
- // D0 RX
- // D2 SDA
- // D3 SCL
- Programming connectors
- Microcontroller
- USB connector
- Buttons
- !RESET! signal
- 3V3 regulation
- GND
- microSD card slot | Flash memory chip
- SPI bus level shifting
- Fiducials
- Artwork | Mounting screws (optional)
- Ground loop

## Library data of the parts
C1 C2 = Custom_RCL_KD:C0805_18PF_50V_NP0: MLCC; CODE: 18p; DNP: F; MANUFACTURER: Samsung; MFG_PARTNO: CL21C180JBANNNC; PRICE: 0.09; SUPPLIER: Digi-Key; SUPPLIER_PARTNO: 1276-1107-1-ND
C3 C4 C7 C8 C20 C46 = Custom_RCL_KD:C0805_1UF_50V_X5R: Multi-Layer Ceramic Capacitor; CODE: 1µF; DNP: F; MANUFACTURER: Murata; MFG_PARTNO: GRM219R61H105KA73D; PRICE: 0.17; SUPPLIER: Digi-Key; SUPPLIER_PARTNO: 490-10743-1-ND
C5 C9 C19 C21 C29-C31 C33 C34 C44 C48 = Custom_RCL_KD:C0603_100NF_50V_X7R; CODE: 100n; DNP: F; MANUFACTURER: Samsung; MFG_PARTNO: CL10B104MB8NNNC; PRICE: 0.01€; SUPPLIER: Digi-Key; SUPPLIER_PARTNO: 1276-1941-1-ND
C6 = Custom_RCL_KD:C0805_10NF_50V_X7R: Multi-Layer Ceramic Capacitor; CODE: 10n; DNP: F; MANUFACTURER: Samsung; MFG_PARTNO: CL21B103KBANNNC; PRICE: 0.01; SUPPLIER: Digi-Key; SUPPLIER_PARTNO: 1276-1015-1-ND
C10 C11 C13-C18 C22-C27 = Custom_RCL_KD:C0805_1NF_50V_X7R: Multi-Layer Ceramic Capacitor; CODE: 1nF; DNP: F; MANUFACTURER: Kemet; MFG_PARTNO: C0805C102K5RACTU; PRICE: 0.09; SUPPLIER: Digi-Key; SUPPLIER_PARTNO: 399-1147-1-ND
C12 = Custom_RCL_KD:C0805_4.7UF_25V_X5R: Multi-Layer Ceramic Capacitor; CODE: 4.7µF; DNP: F; MANUFACTURER: Samsung; MFG_PARTNO: CL21A475KAQNNNG; PRICE: 0.1; SUPPLIER: Digi-Key; SUPPLIER_PARTNO: 1276-6462-1-ND
C28 C32 = Custom_RCL_KD:C1206_10UF_16V_Y5V: Multi-Layer Ceramic Capacitor; CODE: 10u; DNP: F; MANUFACTURER: Yageo; MFG_PARTNO: CC1206ZKY5V7BB106; PRICE: 0.1; SUPPLIER: Mouser; SUPPLIER_PARTNO: 603-CC126ZKY5V7BB106
D1 = Custom_Eagle_KD:DIODE_TVS_5V_BI_824015: Datasheet <http://katalog.we-online.de/pbs/datasheet/824015.pdf> • ESD Protection for 4 high-speed I/O channels and VDD; CODE: 824015; DNP: F; MANUFACTURER: Wurth; MFG_PARTNO: 824015; PRICE: 0.75; SUPPLIER: Digi-Key; SUPPLIER_PARTNO: 732-4467-1-ND
D2 = Custom_Eagle_KD:DIODE_TVS_5V_SMAJ5.0A; CODE: SMAJ5.0A; DNP: F; MANUFACTURER: Vishay Semiconductor Diodes Division; MFG_PARTNO: SMAJ5.0A-E3/61; PRICE: 0.4; SUPPLIER: Digi-Key; SUPPLIER_PARTNO: SMAJ5.0A-E3/61GICT-ND
D3 = Custom_Eagle_KD:LED_0603_GREEN_CLEAR_APTD1608CGCK: Datasheet <http://www.kingbrightusa.com/images/catalog/SPEC/APTD1608CGCK.pdf> Round with Domed Top, 0.70mm 60°; CODE: Green LED; DNP: F; MANUFACTURER: Kingbright; MFG_PARTNO: APTD1608CGCK; PRICE: 0.36€; SUPPLIER: Digi-Key; SUPPLIER_PARTNO: 754-1545-1-ND
D4 D27 = Custom_Eagle_KD:LED_0603_AMBER_DIFF_LOQ976-PS-25: OSRAM Chipled -series; CODE: Orange LED; DNP: F; MANUFACTURER: OSRAM Opto Semiconductors Inc.; MFG_PARTNO: LO Q976-PS-25; PRICE: 0.18; SUPPLIER: Digi-Key; SUPPLIER_PARTNO: 475-2486-1-ND
ENCLOSURE1 = Custom_Eagle_KD:ENCLOSURE_BOPLA_BOP-500-9005: Datasheet <https://www.tme.eu/gb/Document/4d2be67e2f4a42da8c3efe120d2c00b5/BOP-500.pdf> Enclosure: multipurpose; X:75mm; Y:130mm; Z:26mm; BoPad; ABS; black; CODE: BOP 500-9005; DNP: F; MANUFACTURER: BOPLA; MFG_PARTNO: BOP 500-9005; PRICE: 10; SUPPLIER: TME; SUPPLIER_PARTNO: BOP-500-9005
FB1-FB4 FB6 = Custom_RCL_KD:FERRITE_0805_0A5; CODE: 0.4 Ohm / 500 mA; DNP: F; MANUFACTURER: TDK; MFG_PARTNO: MMZ2012Y152B; SUPPLIER: Digi-Key; SUPPLIER_PARTNO: 445-1560-1-ND
FIDUCIAL1-FIDUCIAL6 = Custom_Eagle_KD:FIDUCIAL; CODE: FIDUCIAL; DNP: T; MANUFACTURER: DNP; MFG_PARTNO: DNP; SUPPLIER: DNP; SUPPLIER_PARTNO: DNP
H1-H8 = Custom_Eagle_KD:SWITCH_CAP_DSA_RELEG; CODE: Key Cap; DNP: F; MANUFACTURER: Pimp My Keyboard; MFG_PARTNO: DSA RELEGENDABLES; PRICE: 2; SUPPLIER: Pimp My Keyboard; SUPPLIER_PARTNO: DSA RELEGENDABLES
L1 = Custom_RCL_KD:L_CHOKE_EXC-34CE670U: Common mode choke ● AV equipment (LCD-TV, DVD/Blu-ray drives), Information equipment (PCs, HDD, Printers) ● Noise suppression of high-speed differential data lines such as USB2.0, LVDS, HDMI and LAN https://industrial.panasonic.com/cdbs/www-data/pdf/AWE0000/AWE0000C276.pdf; CODE: EXC-34CE670U; DNP: F; MANUFACTURER: Panasonic; MFG_PARTNO: EXC-34CE670U; PRICE: 0.27; SUPPLIER: Digi-Key; SUPPLIER_PARTNO: P19434CT-ND
LOGO2 = Custom_Eagle_KD:ART_LOGO_TEXT_2.5MM; CODE: Logo text 2.5mm silk; DNP: T; MANUFACTURER: DNP; MFG_PARTNO: DNP; PRICE: 0; SUPPLIER: DNP; SUPPLIER_PARTNO: DNP
R1 R7 = Custom_RCL_KD:R0805_10K_5%; CODE: 10k; DNP: F; MANUFACTURER: Bourns Inc.; MFG_PARTNO: CR0805-JW-103ELF; PRICE: 0.02; SUPPLIER: Digi-Key; SUPPLIER_PARTNO: CR0805-JW-103ELFCT-ND
R2 R3 R13 R18 R23 R25-R30 = Custom_RCL_KD:R0805_1K_1%; CODE: 1k; DNP: F; MANUFACTURER: Yageo; MFG_PARTNO: RC0805FR-071KL; PRICE: 0.09; SUPPLIER: Digi-Key; SUPPLIER_PARTNO: 311-1.00KCRCT-ND
R4 R5 = Custom_RCL_KD:R0603_22; CODE: 22; DNP: F; MANUFACTURER: Panasonic; MFG_PARTNO: ERJ-3EKF22R0V; PRICE: 0.01; SUPPLIER: Mouser; SUPPLIER_PARTNO: 667-ERJ-3EKF22R0V
R6 = Custom_RCL_KD:R0805_1M_5%; CODE: 1M; DNP: F; MANUFACTURER: Yageo; MFG_PARTNO: RC0805JR-071ML; PRICE: 0.09; SUPPLIER: Digikey; SUPPLIER_PARTNO: 311-1.0MARCT-ND
R8-R12 R14 R15 R19 R21 R22 R31 = Custom_RCL_KD:R0805_200_1%; CODE: 200; DNP: F; MANUFACTURER: Yageo; MFG_PARTNO: RC0805FR-07200RL; PRICE: 0.02; SUPPLIER: Digi-Key; SUPPLIER_PARTNO: 311-200CRCT-ND
R16 = Custom_RCL_KD:R0402_DNP; CODE: DNP; DNP: T; MANUFACTURER: DNP; MFG_PARTNO: DNP; PRICE: 0; SUPPLIER: DNP; SUPPLIER_PARTNO: DNP
R17 R20 = Custom_RCL_KD:R0805_3K3_1%; CODE: 3k3; DNP: F; MANUFACTURER: Yageo; MFG_PARTNO: RC0805FR-073K3L; PRICE: 0.02; SUPPLIER: Digi-Key; SUPPLIER_PARTNO: 311-3.30KCRCT-ND
R24 R32 R33 = Custom_RCL_KD:R0603_0; CODE: 0; DNP: F; MANUFACTURER: Panasonic; MFG_PARTNO: ERJ-3GEY0R00V; PRICE: 0.01; SUPPLIER: Mouser; SUPPLIER_PARTNO: 667-ERJ-3GEY0R00V
S1 S3-S9 = Custom_Eagle_KD:SWITCH_BUTTON_MX1A-C1NW: Datasheet <https://media.digikey.com/pdf/Data%20Sheets/Cherry%20PDFs/MX%20Series.pdf>; CODE: MX1A-C1NW; DNP: F; MANUFACTURER: Cherry; MFG_PARTNO: MX1A-C1NW; PRICE: 0.7; SUPPLIER: Digi-Key; SUPPLIER_PARTNO: CH310-ND
S10 = Custom_Eagle_KD:SWITCH_MOM_SPST_FSM4JSMA: SWITCH TACTILE SPST-NO 0.05A 12V; CODE: Button; DNP: F; MANUFACTURER: TE Connectivity; MFG_PARTNO: FSM4JSMA; SUPPLIER: Digi-Key; SUPPLIER_PARTNO: 450-1129-ND
TP1 = Custom_Eagle_KD:PAD_TEST_POINT: Test point. Not populated; CODE: DNP; DNP: T; INFO: CLK 3V3; MANUFACTURER: Do not populate; MFG_PARTNO: DNP; SUPPLIER: DNP; SUPPLIER_PARTNO: DNP
TP2 = Custom_Eagle_KD:PAD_TEST_POINT: Test point. Not populated; CODE: DNP; DNP: T; INFO: CLK 5 V; MANUFACTURER: Do not populate; MFG_PARTNO: DNP; SUPPLIER: DNP; SUPPLIER_PARTNO: DNP
TP3 = Custom_Eagle_KD:PAD_TEST_POINT: Test point. Not populated; CODE: DNP; DNP: T; INFO: 3V3; MANUFACTURER: Do not populate; MFG_PARTNO: DNP; SUPPLIER: DNP; SUPPLIER_PARTNO: DNP
TP5 = Custom_Eagle_KD:PAD_TEST_POINT: Test point. Not populated; CODE: DNP; DNP: T; INFO: !RESET; MANUFACTURER: Do not populate; MFG_PARTNO: DNP; SUPPLIER: DNP; SUPPLIER_PARTNO: DNP
TP7 = Custom_Eagle_KD:PAD_TEST_POINT: Test point. Not populated; CODE: DNP; DNP: T; INFO: 5 V; MANUFACTURER: Do not populate; MFG_PARTNO: DNP; SUPPLIER: DNP; SUPPLIER_PARTNO: DNP
TP15 = Custom_Eagle_KD:PAD_TEST_POINT: Test point. Not populated; CODE: DNP; DNP: T; INFO: CLK_5V; MANUFACTURER: Do not populate; MFG_PARTNO: DNP; SUPPLIER: DNP; SUPPLIER_PARTNO: DNP
TP16 = Custom_Eagle_KD:PAD_TEST_POINT: Test point. Not populated; CODE: DNP; DNP: T; INFO: MISO; MANUFACTURER: Do not populate; MFG_PARTNO: DNP; SUPPLIER: DNP; SUPPLIER_PARTNO: DNP
TP17 = Custom_Eagle_KD:PAD_TEST_POINT: Test point. Not populated; CODE: DNP; DNP: T; INFO: MOSI_5V; MANUFACTURER: Do not populate; MFG_PARTNO: DNP; SUPPLIER: DNP; SUPPLIER_PARTNO: DNP
U1 = Custom_Eagle_KD:IC_MCU_ATMEGA32U4-AU; CODE: ATMEGA32U4; DNP: F; MANUFACTURER: Microchip; MFG_PARTNO: ATMEGA32U4-AU; PRICE: 3.5; SUPPLIER: Digi-Key; SUPPLIER_PARTNO: ATMEGA32U4-AU-ND
U2 = Custom_Eagle_KD:IC_MEM_FLASH_AT45DB321E: Datasheet <http://www.adestotech.com/wp-content/uploads/doc8784.pdf> FLASH Memory IC 32Mb (528 Bytes x 8192 pages) SPI 85MHz 8-SOIC; CODE: AT45DB321E-SHF-T; DNP: F; MANUFACTURER: Adesto Technologies; MFG_PARTNO: AT45DB321E-SHF-T; PRICE: 3.12 USD; SUPPLIER: Digi-Key; SUPPLIER_PARTNO: 1265-1097-1-ND
U3 = Custom_Eagle_KD:IC_REG_3V3_1A_NCP1117LPST33T3G: Datasheet <LINK_ADDRESS>; CODE: 1117-3v3; DNP: F; MANUFACTURER: ON Semiconductor; MFG_PARTNO: NCP1117LPST33T3G; PRICE: 0.5€; SUPPLIER: Digi-Key; SUPPLIER_PARTNO: NCP1117LPST33T3GOSCT-ND
U4-U6 = Custom_Eagle_KD:IC_LEVEL_SHIFTER_SN74LVC2T45: One way Dual voltage translator dual supply 1V65 // 5V5 dir Low = B to A // dir High = A to B F: 1470924 http://www.farnell.com/datasheets/2024285.pdf; CODE: SN74LVC2T45DCTT; DNP: F; MANUFACTURER: Texas Instruments; MFG_PARTNO: SN74LVC2T45DCTT; PRICE: 0.7€; SUPPLIER: Digi-Key; SUPPLIER_PARTNO: 296-32330-1-ND
X1 = Custom_Eagle_KD:CON_USB_MICROB_UJ2-MIBH-4-SMT-TR: Micro B socket; CODE: UJ2-MIBH-4-SMT-TR; DNP: F; MANUFACTURER: CUI; MFG_PARTNO: UJ2-MIBH-4-SMT-TR; PRICE: 1; SUPPLIER: Digi-Key; SUPPLIER_PARTNO: 102-4006-1-ND
X2 = Custom_Eagle_KD:CON_PROG_AVR_ISP; CODE: 1x06 offset; DNP: T; MANUFACTURER: DNP; MFG_PARTNO: DNP; PRICE: 0; SUPPLIER: DNP; SUPPLIER_PARTNO: DNP
X3 = TL_connectors:CON_1X04_TH_OFFSET_PADS: Offset pads in PCB. Will mate with a 2.54 pin header.; CODE: 1X04; DNP: T; MANUFACTURER: DNP; MFG_PARTNO: DNP; SUPPLIER: DNP; SUPPLIER_PARTNO: DNP
X4-X6 X9 X10 X12 X17 X18 = Custom_Eagle_KD:HOL_3.2/6.0_NP: Non-plated mounting hole; CODE: NP 3.2 mm; DNP: T; MANUFACTURER: DNP; MFG_PARTNO: DNP; PRICE: DNP; SUPPLIER: DNP; SUPPLIER_PARTNO: DNP
X11 = Custom_Eagle_KD:CON_MICROSD_MOLEX_5033981892: Datasheet <http://www.molex.com/molex/products/datasheet.jsp?part=active/5033981892_MEMORY_CARD_SOCKET.xml> MICRO SD PUSH/PUSH SMALL 8C; CODE: 503398-1892; DNP: F; MANUFACTURER: Molex; MFG_PARTNO: 5033981892; PRICE: 2.5; SUPPLIER: Digi-Key; SUPPLIER_PARTNO: WM11190CT-ND
X13 = Custom_Eagle_KD:PAD_TEST_GROUND_HOOK; CODE: DNP; DNP: T; MANUFACTURER: Do not populate; MFG_PARTNO: DNP; PRICE: 0; SUPPLIER: DNP; SUPPLIER_PARTNO: DNP
X14 = Custom_Eagle_KD:CON_CLAMP_PTSM_1X04_H_SMD: Datasheet <LINK_ADDRESS>; CODE: 1702474; DNP: F; MANUFACTURER: Phoenix Contact; MFG_PARTNO: 1702474; PRICE: 0.85; SUPPLIER: Digi-Key; SUPPLIER_PARTNO: 277-2338-1-ND
X15 = Custom_Eagle_KD:CON_CLAMP_PTSM_1X08_H_SMD: Datasheet <LINK_ADDRESS>; CODE: 1771088; DNP: F; MANUFACTURER: Phoenix Contact; MFG_PARTNO: 1771088; PRICE: 1.40; SUPPLIER: Digi-Key; SUPPLIER_PARTNO: 277-2071-1-ND
Y1 = Custom_Eagle_KD:OSC_CRYSTAL_16M_ABLS-16.000MHZ-B4-T: Datasheet <http://www.abracon.com/Resonators/abls.pdf>; CODE: 16M; DNP: F; MANUFACTURER: Abracon LLC; MFG_PARTNO: ABLS-16.000MHZ-B4-T; PRICE: 0.21; SUPPLIER: Digi-Key; SUPPLIER_PARTNO: 535-10226-1-ND

## Net classes
0 default: width 0.15 mm
1 PWR: width 0.4 mm
2 +5V: drill 0.5 mm
3 Serial: clearance 0.15 mm
4 +3v3: drill 0.5 mm